# Altium project BLDC_Driver.PrjPcb
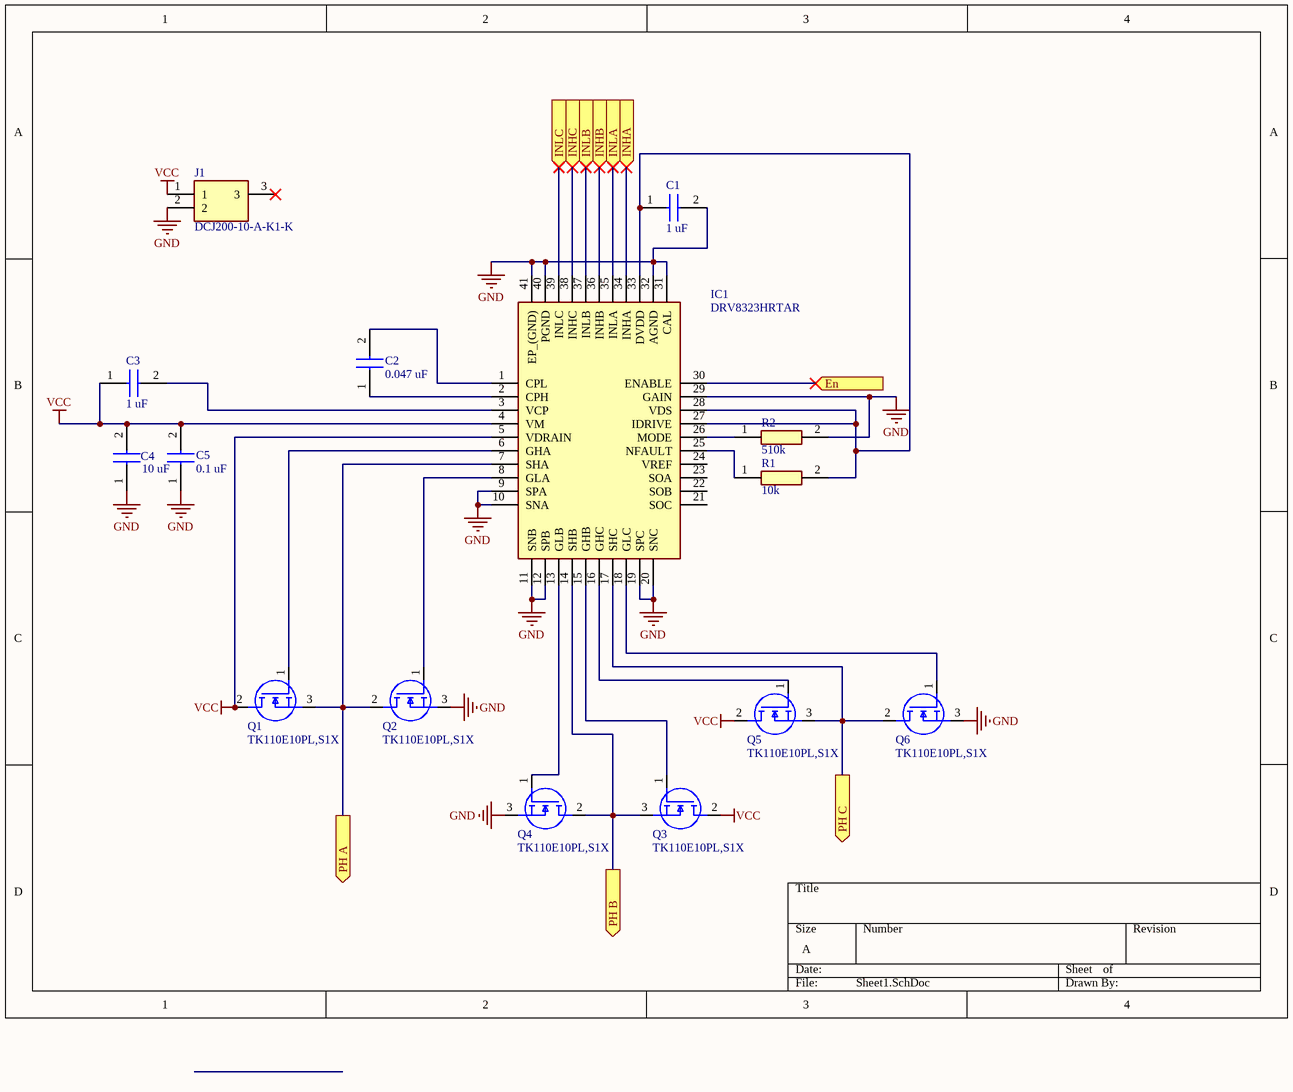
[diagram p0: Sheet1.SchDoc]
1 sheet, 15 parts. Net scope: flat (ports and power ports of the same name join across sheets).
Board file: PCB1.PcbDoc

## Sheet Sheet1.SchDoc
size A; SheetNumber: 1; SheetTotal: 1

### Parts
C1  1 uF  [INDC1608X90N]
C2  0.047 uF  [C0603]
C3  1 uF  [INDC1608X90N]
C4  10 uF  [CAPC3216X180N]
C5  0.1 uF  [CAPC1608X95N]
IC1  DRV8323HRTAR  [QFN50P600X600X80-41N-D]
J1  DCJ200-10-A-K1-K  [DCJ20010AK1K]
Q1  TK110E10PL,S1X  [TO254P465X1016X1935-3P]
Q2  TK110E10PL,S1X  [TO254P465X1016X1935-3P]
Q3  TK110E10PL,S1X  [TO254P465X1016X1935-3P]
Q4  TK110E10PL,S1X  [TO254P465X1016X1935-3P]
Q5  TK110E10PL,S1X  [TO254P465X1016X1935-3P]
Q6  TK110E10PL,S1X  [TO254P465X1016X1935-3P]
R1  10k  [RESC2012X50N]
R2  510k  [RESC3116X65N]

### Ports
En (in), INHA (in), INHB (in), INHC (in), INLA (in), INLB (in), INLC (in), PH A (out), PH B (out), PH C (out)

### Nets
GND: C1.2 C4.1 C5.1 IC1.9(SPA) IC1.10(SNA) IC1.11(SNB) IC1.12(SPB) IC1.19(SPC) IC1.20(SNC) IC1.29(GAIN) IC1.31(CAL) IC1.32(AGND) IC1.40(PGND) IC1.41(EP_(GND)) J1.2 Q2.3(S) Q4.3(S) Q6.3(S) R2.2
VCC: C3.1 C4.2 C5.2 IC1.4(VM) IC1.5(VDRAIN) J1.1 Q1.2(D) Q3.2(D) Q5.2(D)
NetC1_1: C1.1 IC1.27(IDRIVE) IC1.28(VDS) IC1.33(DVDD) R1.2
NetC2_1: C2.1 IC1.2(CPH)
NetC2_2: C2.2 IC1.1(CPL)
NetC3_2: C3.2 IC1.3(VCP)
NetIC1_6: IC1.6(GHA) Q1.1(G)
NetIC1_7: IC1.7(SHA) Q1.3(S) Q2.2(D) ; port PH A
NetIC1_8: IC1.8(GLA) Q2.1(G)
NetIC1_13: IC1.13(GLB) Q4.1(G)
NetIC1_14: IC1.14(SHB) Q3.3(S) Q4.2(D) ; port PH B
NetIC1_15: IC1.15(GHB) Q3.1(G)
NetIC1_16: IC1.16(GHC) Q5.1(G)
NetIC1_17: IC1.17(SHC) Q5.3(S) Q6.2(D) ; port PH C
NetIC1_18: IC1.18(GLC) Q6.1(G)
NetIC1_25: IC1.25(NFAULT) R1.1
NetIC1_26: IC1.26(MODE) R2.1
NetIC1_30: IC1.30(ENABLE) ; port En
NetIC1_34: IC1.34(INHA) ; port INHA
NetIC1_35: IC1.35(INLA) ; port INLA
NetIC1_36: IC1.36(INHB) ; port INHB
NetIC1_37: IC1.37(INLB) ; port INLB
NetIC1_38: IC1.38(INHC) ; port INHC
NetIC1_39: IC1.39(INLC) ; port INLC

Not connected (* = marked no-connect by the designer): IC1 21(SOC) 22(SOB) 23(SOA) 24(VREF); J1 3*

### Library data of the parts
C1 C3 = UMK107BJ105KA-T: Capacitor; Manufacturer_Name: TAIYO YUDEN; Datasheet Link: https://componentsearchengine.com/Datasheets/1/UMK107BJ105KA-T.pdf; Height: 0.9mm; Manufacturer_Part_Number: UMK107BJ105KA-T; Mouser Part Number: 963-UMK107BJ105KA-T; Mouser Price/Stock: https://www.mouser.co.uk/ProductDetail/TAIYO-YUDEN/UMK107BJ105KA-T?qs=PzICbMaShUf8IuXgI3e8WA%3D%3D; Arrow Part Number: UMK107BJ105KA-T; Arrow Price/Stock: https://www.arrow.com/en/products/umk107bj105ka-t/taiyo-yuden?region=nac
C2 = C0603C473K5RACTU: Capacitor; Manufacturer_Name: Yageo Group; Datasheet Link: https://www.yageogroup.com/content/datasheet/asset/file/KEM_C1002_X7R_SMD; Height: 0.87mm; Manufacturer_Part_Number: C0603C473K5RACTU; Mouser Part Number: 80-C0603C473K5R; Mouser Price/Stock: https://www.mouser.co.uk/ProductDetail/KEMET/C0603C473K5RACTU?qs=CDC5R06TEgYvy7Nwr10FTA%3D%3D; Arrow Part Number: C0603C473K5RACTU; Arrow Price/Stock: https://www.arrow.com/en/products/c0603c473k5ractu/kemet-corporation?region=nac
C4 = CL31B106KBHNNNE: Capacitor; Manufacturer_Name: SAMSUNG; Datasheet Link: https://datasheet.datasheetarchive.com/originals/distributors/DKDS-19/375194.pdf; Height: 1.8mm; Manufacturer_Part_Number: CL31B106KBHNNNE; Mouser Part Number: 187-CL31B106KBHNNNE; Mouser Price/Stock: https://www.mouser.co.uk/ProductDetail/Samsung-Electro-Mechanics/CL31B106KBHNNNE?qs=T0XSgvH75d4ZN8WrMi8xmQ%3D%3D; Arrow Part Number: CL31B106KBHNNNE; Arrow Price/Stock: https://www.arrow.com/en/products/cl31b106kbhnnne/samsung-electro-mechanics?utm_currency=USD&region=nac
C5 = C0603C104K5RACTU7042: Capacitor; Manufacturer_Name: Yageo Group; Datasheet Link: https://www.arrow.com/en/products/c0603c104k5ractu7042/kemet-corporation; Height: 0.95mm; Manufacturer_Part_Number: C0603C104K5RACTU7042; Arrow Part Number: C0603C104K5RACTU7042; Arrow Price/Stock: https://www.arrow.com/en/products/c0603c104k5ractu7042/kemet-corporation
IC1 = DRV8323HRTAR: Integrated Circuit; Manufacturer_Name: Texas Instruments; Datasheet Link: http://www.ti.com/lit/gpn/drv8323; Height: 0.8mm; Manufacturer_Part_Number: DRV8323HRTAR; Mouser Part Number: 595-DRV8323HRTAR; Mouser Price/Stock: https://www.mouser.co.uk/ProductDetail/Texas-Instruments/DRV8323HRTAR?qs=u4fy%2FsgLU9N%252BsI8bz2iwaQ%3D%3D; Arrow Part Number: DRV8323HRTAR; Arrow Price/Stock: https://www.arrow.com/en/products/drv8323hrtar/texas-instruments?utm_currency=USD&region=nac
J1 = DCJ200-10-A-K1-K: Connector; Manufacturer_Name: GCT (GLOBAL CONNECTOR TECHNOLOGY); Datasheet Link: https://gct.co/files/drawings/dcj200-10.pdf; Height: 11mm; Manufacturer_Part_Number: DCJ200-10-A-K1-K; Mouser Part Number: 640-DCJ200-10-A-K1-K; Mouser Price/Stock: https://www.mouser.co.uk/ProductDetail/GCT/DCJ200-10-A-K1-K?qs=KUoIvG%2F9Ilayx8ZZ1Qrlrg%3D%3D
Q1-Q6 = TK110E10PL,S1X: MOSFET (N-Channel); Manufacturer_Name: Toshiba; Datasheet Link: https://toshiba.semicon-storage.com/; Height: 4.65mm; Manufacturer_Part_Number: TK110E10PL,S1X; Mouser Part Number: 757-TK110E10PLS1X; Mouser Price/Stock: https://www.mouser.co.uk/ProductDetail/Toshiba/TK110E10PLS1X?qs=d0WKAl%252BL4KYZJ4mCEXbHOw%3D%3D; Arrow Part Number: TK110E10PL,S1X; Arrow Price/Stock: https://www.arrow.com/en/products/tk110e10pls1x/toshiba
R1 = CRCW080510K0FKEA: Resistor 10K; Manufacturer_Name: Vishay; Datasheet Link: http://www.vishay.com/docs/20035/dcrcwe3.pdf; Height: 0.5mm; Manufacturer_Part_Number: CRCW080510K0FKEA; Mouser Part Number: 71-CRCW0805-10K-E3; Mouser Price/Stock: https://www.mouser.co.uk/ProductDetail/Vishay-Dale/CRCW080510K0FKEA?qs=LOX6nxTstiZjDFtI%2F0c8Lw%3D%3D; Arrow Part Number: CRCW080510K0FKEA; Arrow Price/Stock: https://www.arrow.com/en/products/crcw080510k0fkea/vishay?utm_currency=USD&region=nac
R2 = RC1206FR-07510KL: Resistor 510K; Manufacturer_Name: Yageo Group; Datasheet Link: https://www.sos.sk/productdata/35/10/4/35104/RC1206.pdf; Height: 0.65mm; Manufacturer_Part_Number: RC1206FR-07510KL; Mouser Part Number: 603-RC1206FR-07510KL; Mouser Price/Stock: https://www.mouser.com/Search/Refine.aspx?Keyword=603-RC1206FR-07510KL